# Altium schematic sheet 07_ETHERNET & ZIGBEE.SchDoc
size 420 x 297 mm
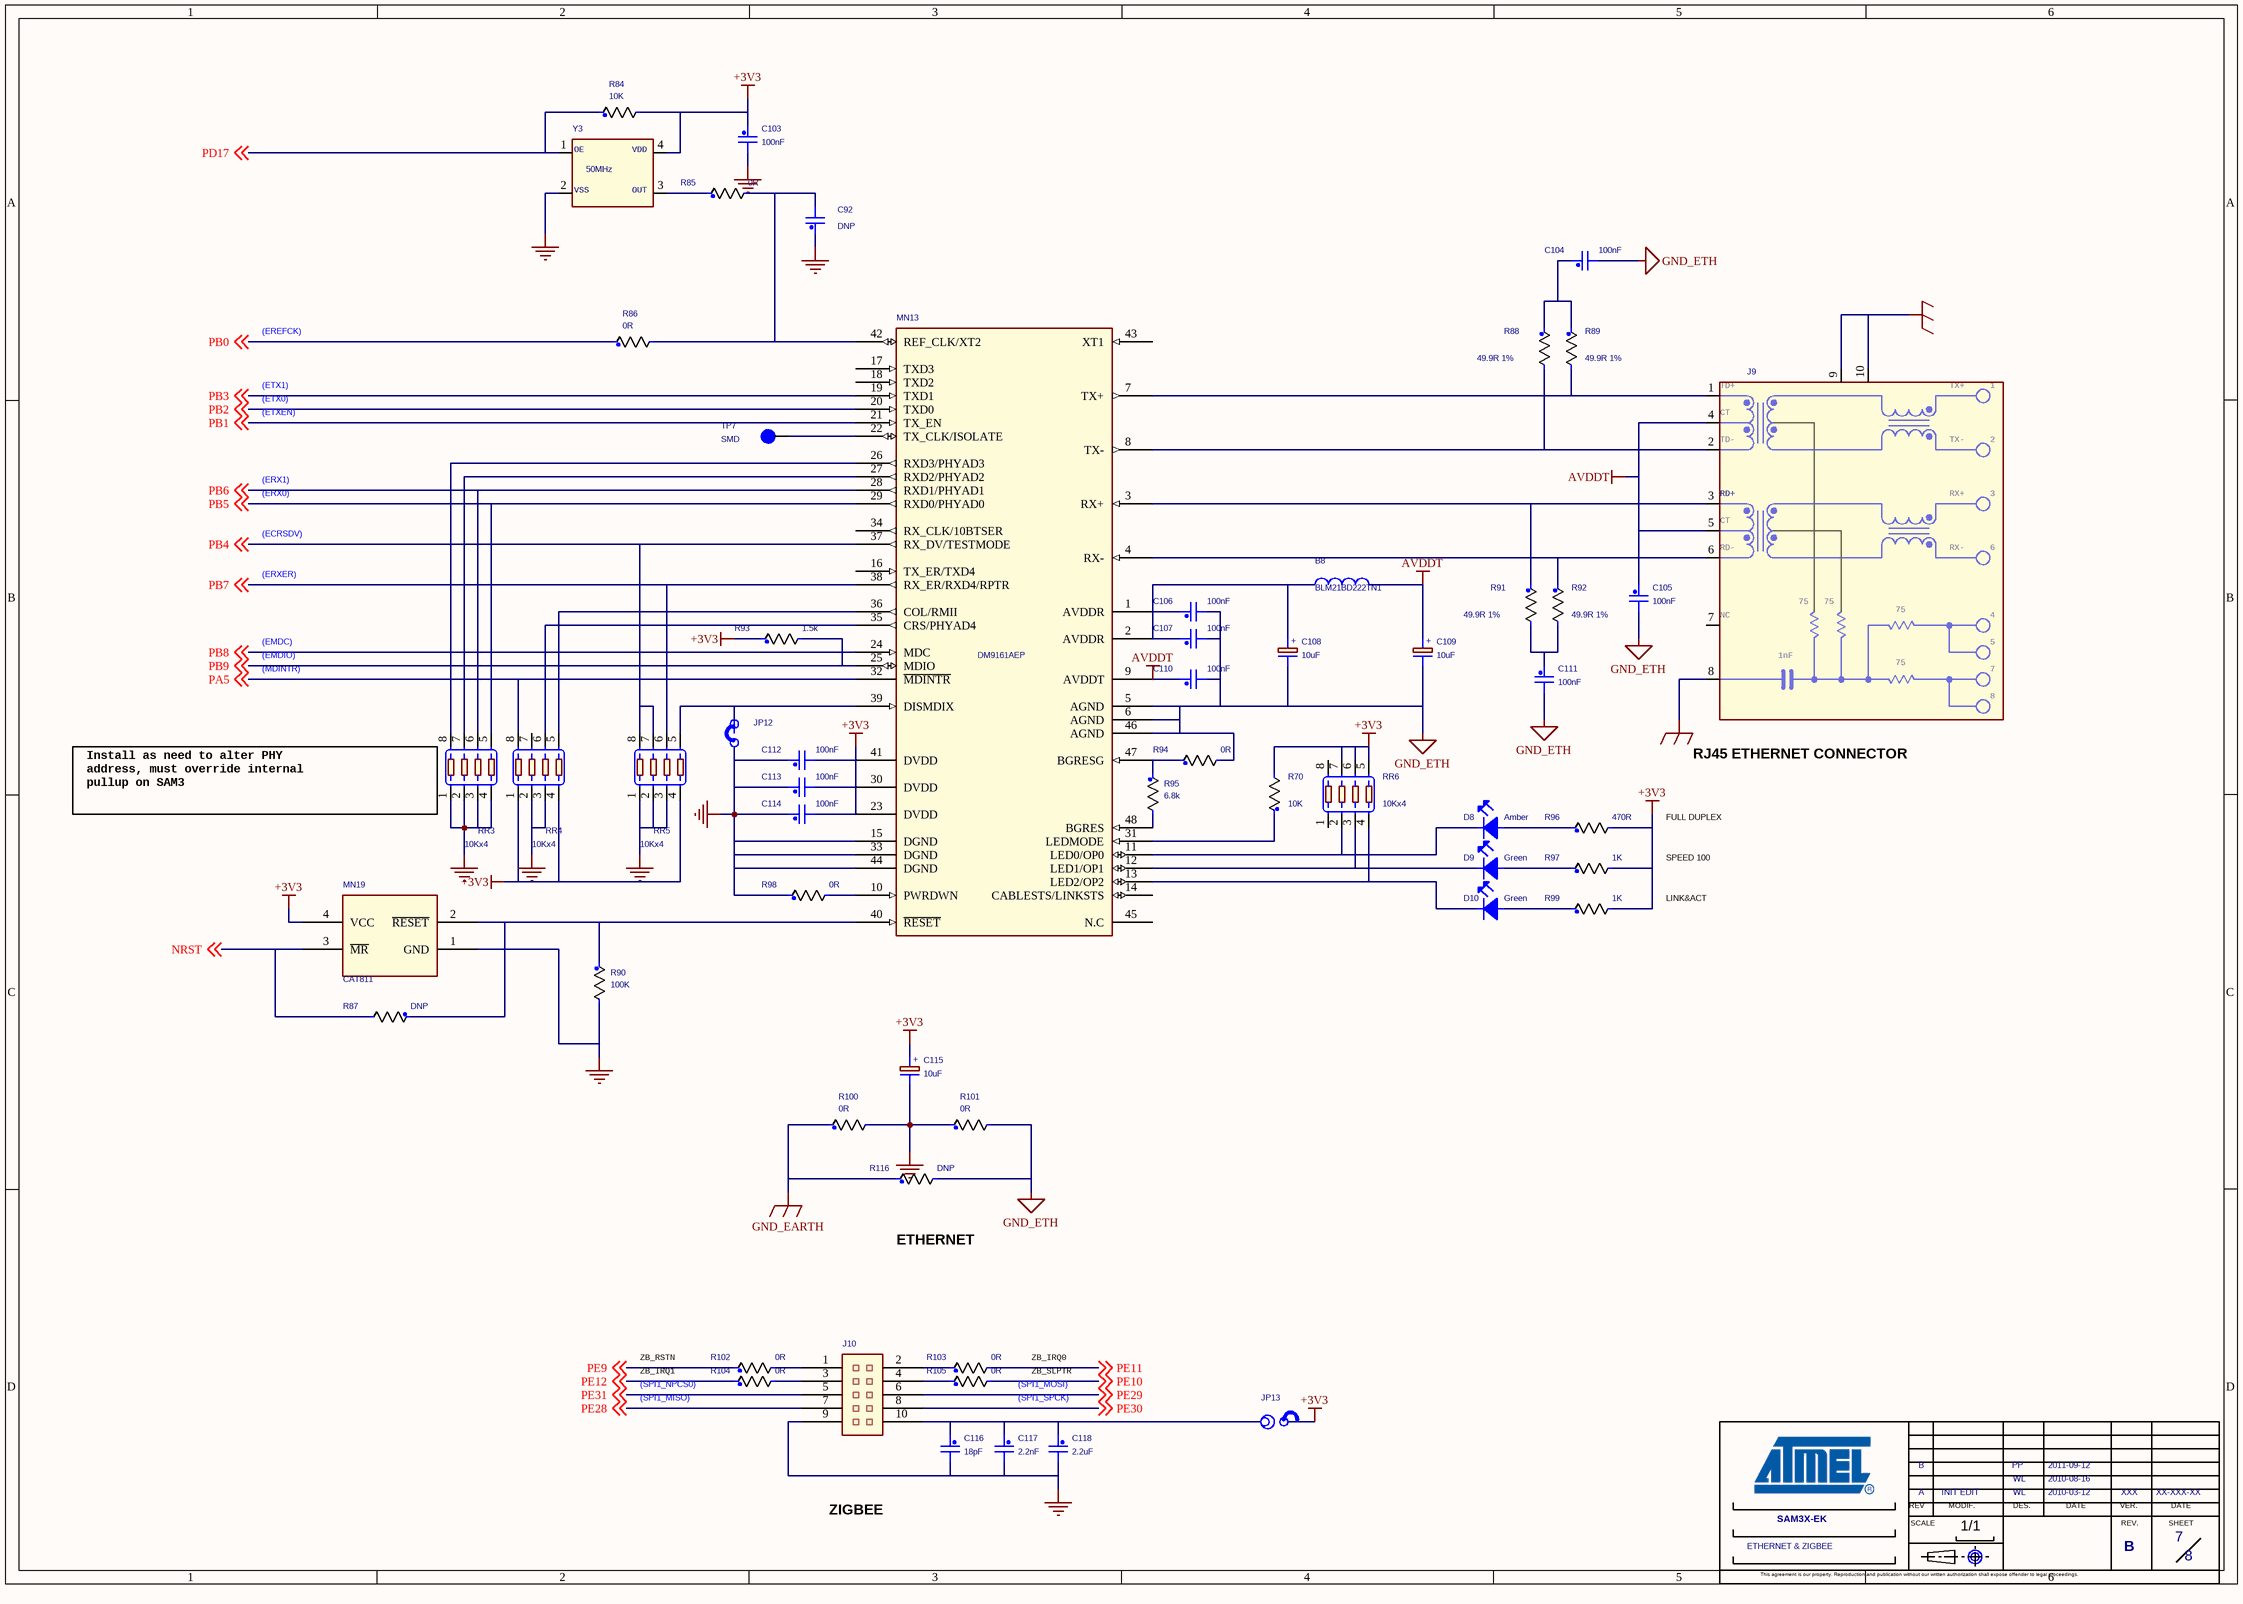
[diagram p0: 07_ETHERNET & ZIGBEE.SchDoc]

## Parts
*  SHEET NAME 1: ETHERNET & ZIGBEE  REV C: B  VERIF A: XXX  VERIF DATE A: XX-XXX-XX  Page Count: 8  Page Number: 7  DATE A: 2010-03-12  DATE B: 2010-08-16  DATE C: 2011-09-12  DES A: WL  DES C: PP  BOARD NAME: SAM3X-EK  VERSION: A  MODIF. DESCRIBE: INIT EDIT  (hidden comment: ATMEL ARM)  (graphical)
B8  BLM21BD222TN1  [LC1206]
C92  DNP  [CAP0805]
C103  100nF  [CAP0805]
C104  100nF  [CAP0805]
C105  100nF  [CAP0805]
C106  100nF  [CAP0805]
C107  100nF  [CAP0805]
C108  10uF  [C3216-18]
C109  10uF  [C3216-18]
C110  100nF  [CAP0805]
C111  100nF  [CAP0805]
C112  100nF  [CAP0805]
C113  100nF  [CAP0805]
C114  100nF  [CAP0805]
C115  10uF  [C3216-18]
C116  18pF  [CAP0805]
C117  2.2nF  [CAP0805]
C118  2.2uF  [CAP0805]
D8  Amber  [LED0805]
D9  Green  [LED0805]
D10  Green  [LED0805]
J9  13F-64NDXNL  [RJ45_PULSE]  (value not drawn)
J10  SDIC10  [SIDC10]  (value not drawn)
JP12  JP  [BAR2PTS02]  (value not drawn)
JP13  JP  [BAR2PTS02]  (value not drawn)
MN13  DM9161AEP  [lqfp48]
MN19  CAT811  [SOT143]
R70  10K  [R0603]
R84  10K  [R0603]
R85  0R  [R0603]
R86  0R  [R0603]
R87  DNP  [R0603]
R88  49.9R 1%  [R0603]
R89  49.9R 1%  [R0603]
R90  100K  [R0603]
R91  49.9R 1%  [R0603]
R92  49.9R 1%  [R0603]
R93  1.5k  [r0603]
R94  0R  [R0603]
R95  6.8k  [R0603]
R96  470R  [R0603]
R97  1K  [r0603]
R98  0R  [R0603]
R99  1K  [r0603]
R100  0R  [R0603]
R101  0R  [R0603]
R102  0R  [r0603]
R103  0R  [r0603]
R104  0R  [r0603]
R105  0R  [r0603]
R116  DNP  [R0603]
RR3  10Kx4  [RESP4R]
RR4  10Kx4  [RESP4R]
RR5  10Kx4  [RESP4R]
RR6  10Kx4  [RESP4R]
SH18  Jumper Pitch 2.54  [JUMPER-2.54]  (value not drawn)
SH19  Jumper Pitch 2.54  [JUMPER-2.54]  (value not drawn)
TP7  SMD  [P1A]
Y3  50MHz  [OS-5032]

## Nets
+3V3: C103.1 C112.2 C113.2 C114.2 C115.1 JP13.2 MN13.23(DVDD) MN13.30(DVDD) MN13.41(DVDD) MN19.4(VCC) R70.2 R84.2 R93.1 R96.2 R97.2 R99.2 RR4.1 RR4.4 RR5.4 RR6.5 RR6.6 RR6.7 Y3.4(VDD)
AVDDT: B8.2 C105.1 C109.1 C110.1 J9.4(P4) J9.5(P5) MN13.9(AVDDT)
GND_EARTH: J9.8(P8) J9.9(P9) J9.10(P10) R100.1 R116.1
GND_ETH: C104.2 C105.2 C106.2 C107.2 C108.2 C109.2 C110.2 C111.2 MN13.5(AGND) MN13.6(AGND) MN13.46(AGND) R94.2 R101.2 R116.2
GND_POWER: C92.1 C103.2 C112.1 C113.1 C114.1 C115.2 C116.2 C117.2 C118.2 J10.9 JP12.2 MN13.15(DGND) MN13.33(DGND) MN13.44(DGND) MN19.1(GND) R90.2 R98.1 R100.2 R101.1 RR3.1 RR3.2 RR3.3 RR3.4 RR4.2 RR4.3 RR5.1 RR5.2 RR5.3 Y3.2(VSS)
NRST: MN19.3(~{MR}) R87.2 ; off-sheet NRST
PA5: MN13.32(~{MDINTR}) RR4.8 ; off-sheet PA5
PB0: R86.1 ; off-sheet PB0
PB1: MN13.21(TX_EN) ; off-sheet PB1
PB2: MN13.20(TXD0) ; off-sheet PB2
PB3: MN13.19(TXD1) ; off-sheet PB3
PB4: MN13.37(RX_DV/TESTMODE) RR5.7 RR5.8 ; off-sheet PB4
PB5: MN13.29(RXD0/PHYAD0) RR3.5 ; off-sheet PB5
PB6: MN13.28(RXD1/PHYAD1) RR3.6 ; off-sheet PB6
PB7: MN13.38(RX_ER/RXD4/RPTR) RR5.6 ; off-sheet PB7
PB8: MN13.24(MDC) ; off-sheet PB8
PB9: MN13.25(MDIO) R93.2 ; off-sheet PB9
PD17: R84.1 Y3.1(OE) ; off-sheet PD17
PE9: R102.1 ; off-sheet PE9
PE10: R105.2 ; off-sheet PE10
PE11: R103.2 ; off-sheet PE11
PE12: R104.1 ; off-sheet PE12
PE28: J10.7 ; off-sheet PE28
PE29: J10.6 ; off-sheet PE29
PE30: J10.8 ; off-sheet PE30
PE31: J10.5 ; off-sheet PE31
NetB8_1: B8.1 C106.1 C107.1 C108.1 MN13.1(AVDDR) MN13.2(AVDDR)
NetC92_2: C92.2 MN13.42(REF_CLK/XT2) R85.2 R86.2
NetC104_1: C104.1 R88.1 R89.1
NetC111_1: C111.1 R91.2 R92.2
NetC116_1: C116.1 C117.1 C118.1 J10.10 JP13.1
NetD8_1: D8.1(A) R96.1
NetD8_2: D8.2(K) MN13.11(LED0/OP0) RR6.2
NetD9_1: D9.1(A) R97.1
NetD9_2: D9.2(K) MN13.12(LED1/OP1) RR6.3
NetD10_1: D10.1(A) R99.1
NetD10_2: D10.2(K) MN13.13(LED2/OP2) RR6.4
NetJ9_1: J9.1(P1) MN13.7(TX+) R89.2
NetJ9_2: J9.2(P2) MN13.8(TX-) R88.2
NetJ9_3: J9.3(P3) MN13.3(RX+) R91.1
NetJ9_6: J9.6(P6) MN13.4(RX-) R92.1
NetJ10_1: J10.1 R102.2
NetJ10_2: J10.2 R103.1
NetJ10_3: J10.3 R104.2
NetJ10_4: J10.4 R105.1
NetJP12_1: JP12.1 MN13.39(DISMDIX) RR5.5
NetMN13_10: MN13.10(PWRDWN) R98.2
NetMN13_22: MN13.22(TX_CLK/ISOLATE) TP7.1(TP)
NetMN13_26: MN13.26(RXD3/PHYAD3) RR3.8
NetMN13_27: MN13.27(RXD2/PHYAD2) RR3.7
NetMN13_31: MN13.31(LEDMODE) R70.1
NetMN13_35: MN13.35(CRS/PHYAD4) RR4.6
NetMN13_36: MN13.36(COL/RMII) RR4.5
NetMN13_40: MN13.40(~{RESET}) MN19.2(~{RESET}) R87.1 R90.1
NetMN13_47: MN13.47(BGRESG) R94.1 R95.1
NetMN13_48: MN13.48(BGRES) R95.2
NetR85_1: R85.1 Y3.3(OUT)

Not connected (* = marked no-connect by the designer): J9 7(P7); MN13 14(CABLESTS/LINKSTS) 16(TX_ER/TXD4) 17(TXD3) 18(TXD2) 34(RX_CLK/10BTSER) 43(XT1) 45(N.C); RR4 7; RR6 1 8

## Notes on the sheet
- (ETX1)
- (EREFCK)
- (ETX0)
- (ETXEN)
- (ERX1)
- (ERX0)
- (ERXER)
- (ECRSDV)
- (EMDC)
- (EMDIO)
- (MDINTR)
- (near RR3) Install as need to alter PHY
  address, must override internal
  pullup on SAM3
- RJ45 ETHERNET CONNECTOR
- SPEED 100
- FULL DUPLEX
- LINK&ACT
- ETHERNET
- (SPI1_NPCS0)
- (SPI1_MISO)
- ZB_IRQ1
- ZB_RSTN
- (SPI1_MOSI)
- (SPI1_SPCK)
- ZB_IRQ0
- ZB_SLPTR
- ZIGBEE
- (in symbol ATMEL ARM) REV; MODIF.; DES.; DATE; VER.; SCALE; REV.; SHEET; 1/1; This agreement is our property. Reproduction and publication without our written authorization shall expose offender to legal proceedings.
- (in symbol CAP_PN) +
- (in symbol RJ45 MAGNETICS) TD+; TX+; CT; TD-; TX-; RD+; RX+; RD-; RX-; 75; NC; 1nF

## Library data of the parts
* = ATMEL ARM: REV D: D; REV F: F; REV E: E; REV B: B; VERIF F: XXX; VERIF E: XXX; VERIF D: XXX; VERIF C: XXX; VERIF B: XXX; VERIF DATE F: XX-XXX-XX; VERIF DATE E: XX-XXX-XX; VERIF DATE D: XX-XXX-XX; VERIF DATE C: XX-XXX-XX; REV: B; VERIF DATE B: XX-XXX-XX; FT: ?; Page Size: A; Page Create Date: june 19, 2004; DATE D: XX-XXX-XX; DATE E: XX-XXX-XX; DATE F: XX-XXX-XX; DES E: XXX; DES F: XXX; DES B: WL; DES D: XXX
B8 = inductor: VAL: 2200ohm@100MHz; FAB: Wurth Electronics Inc; DEV: R0805; DESIG: SMD EMI Suppression Ferrite Beads; BOI: 0805; REF: BLM21BD222TN1
C92 = C_Generic: Toler.: 10%; P/N #1: C0603C104K4RAC; Voltage: 16V; Mfg #1: KEMET; Dielectric: X7R; TEN: 50V; VAL: 68pF; REF: C1608X7R1H680KT; FAB: TDK; DEV: C0603; DESIG: Ceramic capacitor; BOI: 0603; TOL: 10%
C103 C104 = C_Generic: Toler.: 10%; P/N #1: C0603C104K4RAC; Voltage: 16V; Mfg #1: KEMET; Dielectric: X7R; REF: C1608X7R1C104KT; FAB: TDK; DEV: C0603; DESIG: Ceramic Capacitor; BOI: 0603; TOL: 10%; TEN: 16V; VAL: 100nF
C105-C107 C110-C114 = C_Generic: Toler.: 10%; P/N #1: C0603C104K4RAC; Voltage: 16V; Mfg #1: KEMET; Dielectric: X7R; BOI: 0603; DESIG: Ceramic Capacitor; DEV: C0603; FAB: TDK; REF: C1608X7R1C104KT; VAL: 100nF; TEN: 16V; TOL: 10%
C108 C109 C115 = CAP_PN: SDTSourceLibName: C:\WINDOWS\TEMP\SNDS.LIB; BOI: A; DESIG: LOW ESR TANTALUM CAPACITOR; DEV: 3216; FAB: AVX; REF: TPSA106K010R1800; TEN: 10V; TOL: 10%; Dielectric: X5R; VAL: 10uF
C116 = C_Generic: Toler.: 10%; P/N #1: C0603C104K4RAC; Voltage: 50V; Mfg #1: KEMET; Dielectric: X7R; BOI: 0603; DESIG: Ceramic capacitor; DEV: C0603; FAB: TDK; REF: C1608X7R1H180KT; VAL: 18pF; TEN: 50V; TOL: 10%
C117 = C_Generic: Toler.: 10%; P/N #1: C0603C104K4RAC; Voltage: 50V; Mfg #1: KEMET; Dielectric: X7R; REF: C1608X7R1H222KT; FAB: TDK; DEV: C0603; DESIG: Ceramic capacitor; BOI: 0603; TOL: 10%; TEN: 50V; VAL: 2.2nF
C118 = C_Generic: Toler.: 10%; P/N #1: C0603C104K4RAC; Voltage: 50V; Mfg #1: KEMET; Dielectric: X5R; BOI: 0805; DESIG: X5R CERAMIC CAPACITOR; DEV: C0805; FAB: TDK; REF: C2012X5R1C225KT; VAL: 2.2uF; TEN: 50V; TOL: 10%
D8 = LED_Small_1: Note: 0805; DESIG: Chip Led Green; FAB: AVAGO; REF: HSMA-C170; BOI: 0805; VAL: HSMA-C170
D9 D10 = LED_Small_1: Note: 0805; VAL: HSMG-C170; FAB: AVAGO; DESIG: Chip Led Green; REF: HSMG-C170; BOI: 0805
J9 = RJ45 MAGNETICS: DESIG: 10/100 Base-TX RJ45 1x1 Tab-DOWN 8-pin Integrated Magnetics Connector.; BOI: RJ45; FAB: YUAN DEAN; RoHS: YES; REF: 13F-64NDXNL
J10 = SDIC10: DESIG: 2.54mm male Header,Dual Row,Straight (10PIN); FAB: SHENZHEN SITUO; REF: 098; VAL: 098
JP12 JP13 = JUMP_0: VAL: 045; FAB: SHENZHEN SITUO; DESIG: 2.54mm Pin Header,Single Row,Straight/Right Angle(2pin); REF: 045
MN13 = DM9161AE_0: IC,Com IC,10/100 ETH MAC with PHY,LQFP48; Part Number: 153-00004-1; DESIG: 10/100 Fast Ethernet Tranceiver MII/RMII Auto MDIX; FAB: DAVICOM; DEV: QFP48_01; REF: DM9161AEP; BOI: LQFP48; VAL: DM9161AEP; Part Type: Communication IC; Manufacturer: DAVICOM; Manufacturer Part Number: DM9161AEP
MN19 = CAT811: FAB: ON; REF: CAT811; VAL: CAT811
R70 R84 R87 = R_Generic: P/N #1: CR10-1001F-T; BOI: 0603; DESIG: RC21 5%; FAB: YAGEO; REF: RC0603JR-0710KL; TOL: 5%; DEV: R0603
  R70 R84: VAL: 10K
  R87: VAL: DNP
R85 R86 R94 R100 R101 R104 R105 = R_Generic: P/N #1: CR10-1001F-T; TOL: 5%; REF: RC0603JR-070RL; FAB: YAGEO; DESIG: RC21 5%; BOI: 0603; VAL: 0R; DEV: R0603
R88 R89 R92 = R_Generic: P/N #1: CR10-1001F-T; BOI: 0603; DESIG: RC22H 1%; FAB: YAGEO; REF: RC0603FR-0749R9L; DEV: R0603; VAL: 49.9R; TOL: 1%
R90 = R_Generic: P/N #1: CR10-1001F-T; BOI: 0603; DESIG: RC21 5%; FAB: YAGEO; REF: RC0603JR-07100KL; TOL: 5%; DEV: R0603; VAL: 100K
R91 = R_Generic: P/N #1: CR10-1001F-T; REF: RC0603FR-0749R9L; FAB: YAGEO; DESIG: RC22H 1%; BOI: 0603; TOL: 1%; VAL: 49.9R; DEV: R0603
R93 = R_Generic: P/N #1: CR10-1001F-T; BOI: 0603; DESIG: RC21 5%; FAB: YAGEO; REF: RC0603JR-071K5L; TOL: 5%; DEV: R0603; VAL: 1.5K
R95 = R_Generic: P/N #1: CR10-1001F-T; TOL: 5%; REF: RC0603JR-076K8L; FAB: YAGEO; DESIG: RC21 5%; BOI: 0603; VAL: 6.8K; DEV: R0603
R96 = R_Generic: P/N #1: CR10-1001F-T; TOL: 5%; REF: RC0603JR-07470RL; FAB: YAGEO; DESIG: RC21 5%; BOI: 0603; VAL: 470R; DEV: R0603
R97 R99 = R_Generic: P/N #1: CR10-1001F-T; TOL: 5%; REF: RC0603JR-071KL; FAB: YAGEO; DESIG: RC21 5%; BOI: 0603; VAL: 1K; DEV: R0603
R98 R102 R103 = R_Generic: P/N #1: CR10-1001F-T; BOI: 0603; DESIG: RC21 5%; FAB: YAGEO; REF: RC0603JR-070RL; TOL: 5%; DEV: R0603; VAL: 0R
R116 = R_Generic: P/N #1: CR10-1001F-T; BOI: 0603; DESIG: RC21 5%; FAB: YAGEO; REF: RC0603JR-070RL; VAL: 0R; TOL: 5%; DEV: R0603
RR3 RR4 RR6 = RES_ARRAY: TOL: 5%; REF: YC124JR-0710K; FAB: YAGEO; DESIG: Chip Resistor Arrays; BOI: YC124; VAL: 10Kx4
RR5 = RES_ARRAY: BOI: YC124; DESIG: Chip Resistor Arrays; FAB: YAGEO; REF: YC124JR-0710K; TOL: 5%; VAL: 10Kx4
SH18 = JUMPER-2.54: Jumper,2 Points Jumper Pitch 2.54; Part Number: 440-00002-1; Manufacturer: WIESON; Manufacturer Part Number: G4160-1A60BF1U; FAB: NA; REF: JUMPER 2.54; DESIG: 2 POINTS JUMPER PITCH 2.54; VAL: JUMPER 2.54; BOI: NA; Part Type: Jumper
SH19 = JUMPER-2.54: Jumper,2 Points Jumper Pitch 2.54; Manufacturer Part Number: G4160-1A60BF1U; Manufacturer: WIESON; Part Number: 440-00002-1; FAB: NA; REF: JUMPER 2.54; DESIG: 2 POINTS JUMPER PITCH 2.54; VAL: JUMPER 2.54; BOI: NA; Part Type: Jumper
TP7 = TP: DESIG: testing PAD; FAB: NA; VAL: NOT POPULATED; REF: NA
Y3 = Oscillator: OSC,50MHz,3V3,50ppm,15pF,ROHS; FAB: ECEC; Part Type: Clock; Manufacturer Part Number: OS-5032; RoHS: Yes